# Altium project LEDS_UV.PrjPcb
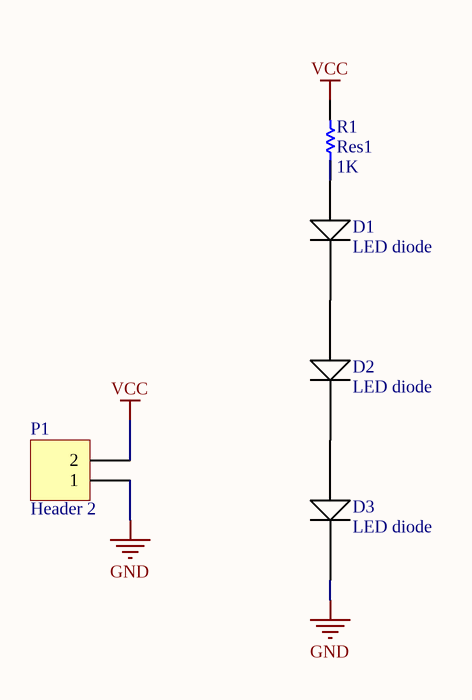
[diagram p0: LEDS_BOARD.SchDoc]
1 sheet, 5 parts. Net scope: global (net labels, ports and power ports of the same name join across sheets).
Board file: PCB_LEDS.PcbDoc

## Sheet LEDS_BOARD.SchDoc
size A4

### Parts
D1  LED diode  [led_UV]
D2  LED diode  [led_UV]
D3  LED diode  [led_UV]
P1  Header 2  [HDR1X2]
R1  Res1  value 1K  [AXIAL-0.3]

### Nets
GND: D3.0 P1.1
VCC: P1.2 R1.2
NetD1_0: D1.0 D2.1
NetD1_1: D1.1 R1.1
NetD2_0: D2.0 D3.1

### Library data of the parts
D1-D3 = LED_UV: standar through hole led diode
P1 = Header 2: Header, 2-Pin; LatestRevisionDate: 17-Jul-2002; LatestRevisionNote: Re-released for DXP Platform.; Publisher: Altium Limited
R1 = Res1: Resistor; Published: 8-Jun-2000; LatestRevisionDate: 17-Jul-2002; LatestRevisionNote: Re-released for DXP Platform.; PackageReference: AXIAL-0.3; Publisher: Altium Limited; PackageDescription: Axial Device, Thru-Hole; 2 Leads; 0.3 in Pin Spacing